# Altium schematic sheet TEMP.SchDoc
size A; SheetNumber: 4; SheetTotal: 4
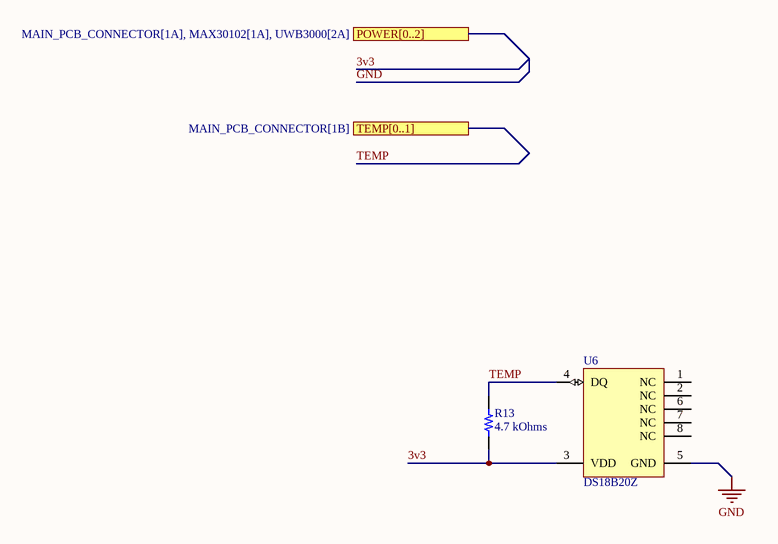
[diagram p0: TEMP.SchDoc]

## Parts
R13  4.7 kOhms  [RES 0402_1005]
U6  DS18B20Z  [MAXM-S8-2_N]

## Ports
POWER[0..2] (see MAIN_PCB_CONNECTOR[1A], MAX30102[1A], UWB3000[2A]), TEMP[0..1] (see MAIN_PCB_CONNECTOR[1B])

## Nets
GND: U6.5(GND)
3v3: R13.1 U6.3(VDD)
TEMP: R13.2 U6.4(DQ)

Not connected (* = marked no-connect by the designer): U6 1(NC) 2(NC) 6(NC) 7(NC) 8(NC)

## Library data of the parts
R13 = RR0510P-472-D: RES SMD 4.7K OHM 0.5% 1/16W 0402; Manufacturer: UNI-ROYAL(Uniroyal Elec); MFR.Part #: 0402WGF4701TCE; Power (Watts): 0.063W, 1/16W; Temperature Coefficient: ±25ppm/°C; Part Number: RR0510P-472-D; Value: 4.7 kOhms; ComponentLink1Description: Datasheet; ComponentLink1URL: http://www.susumu.co.jp/common/pdf/n_catalog_partition05_en.pdf; ComponentLink2Description: DigiKey Link; ComponentLink2URL: https://www.digikey.com/en/products/detail/susumu/RR0510P-472-D/432413; Composition: Thin Film; Device Package: 0402 (1005 Metric); Height - Seated (Max): 0.016" (0.40mm); LastUpdated: 2/9/2024 8:30:21 PM; Lifecycle Status: Active; Minimum Order: 1; Number of Terminations: 2; Operating Temperature: -55°C ~ 125°C; Package / Case: 0402 (1005 Metric); Packaging: TapeAndReel; PartId: 3209; Part Status: Active; Price: 0.01; Resistance: 4.7 kOhms; Series: RR; Size / Dimension: 0.039" L x 0.020" W (1.00mm x 0.50mm); Supplier 1: DigiKey; Supplier Part Number 1: RR05P4.7KDCT-ND; Tolerance: ±0.5%; JLCPCB Part #: C25900
U6 = CMP-0253-00023-2: High-Precision 1-Wire Digital Thermometer, -55 to 125 degC, 8-Pin SOIC (S8-2); Manufacturer: Analog Devices Inc./Maxim Integrated; MFR.Part #: DS18B20Z+T&R; Parasite Pwr.: Yes; Temp. Thresh.: Programmable (NV); Sensor Type: Local; Code_JEDEC: MS012; Mounting Technology: Surface Mount; ComponentLink3Description: Package Specification; PartNumber: DS18B20Z; ComponentLink2Description: Datasheet; ComponentLink3URL: http://pdfserv.maximintegrated.com/package_dwgs/21-0041.PDF; PackageVersion: Rev. D, 10/2012; ComponentLink1URL: http://www.maximintegrated.com/; Multi Droppable: Yes; ComponentLink1Description: Manufacturer URL; ComponentLink2URL: http://datasheets.maximintegrated.com/en/ds/DS18B20.pdf; Generic Part Number: DS18B20; PackageReference: S8-2; PackageDescription: 8-Pin Small-Outline IC, Narrow (0.15in) (S8-2), Body 4.90 x 3.90 mm, Pitch 1.27 mm; Interface: 1-Wire; DatasheetVersion: Rev. 4; Parameter 1: *; JLCPCB Part #: C97190